# Altium schematic sheet USB_OTG .SchDoc: USB OTG HS
size A4; Project: STM32H7-DK; Date: Not used; ApprovedBy: Not used; CheckedBy: Not used; Author: Not used; CompanyName: STMicroelectronics; DrawnBy: Not used; Engineer: Not used; Organization: Not used; Address1: Not used; Address2: Not used; Address3: Not used; Address4: Not used; DocumentNumber: Not used; Revision: Not used; SheetNumber: 15; SheetTotal: 16; CurrentTime: Not used; CurrentDate: Not used; Time: Not used; DocumentFullPathAndName: Not used; DocumentName: Not used; ModifiedDate: Not used; ImagePath: Not used; ProjectName: Not used; Application_BuildNumber: Not used
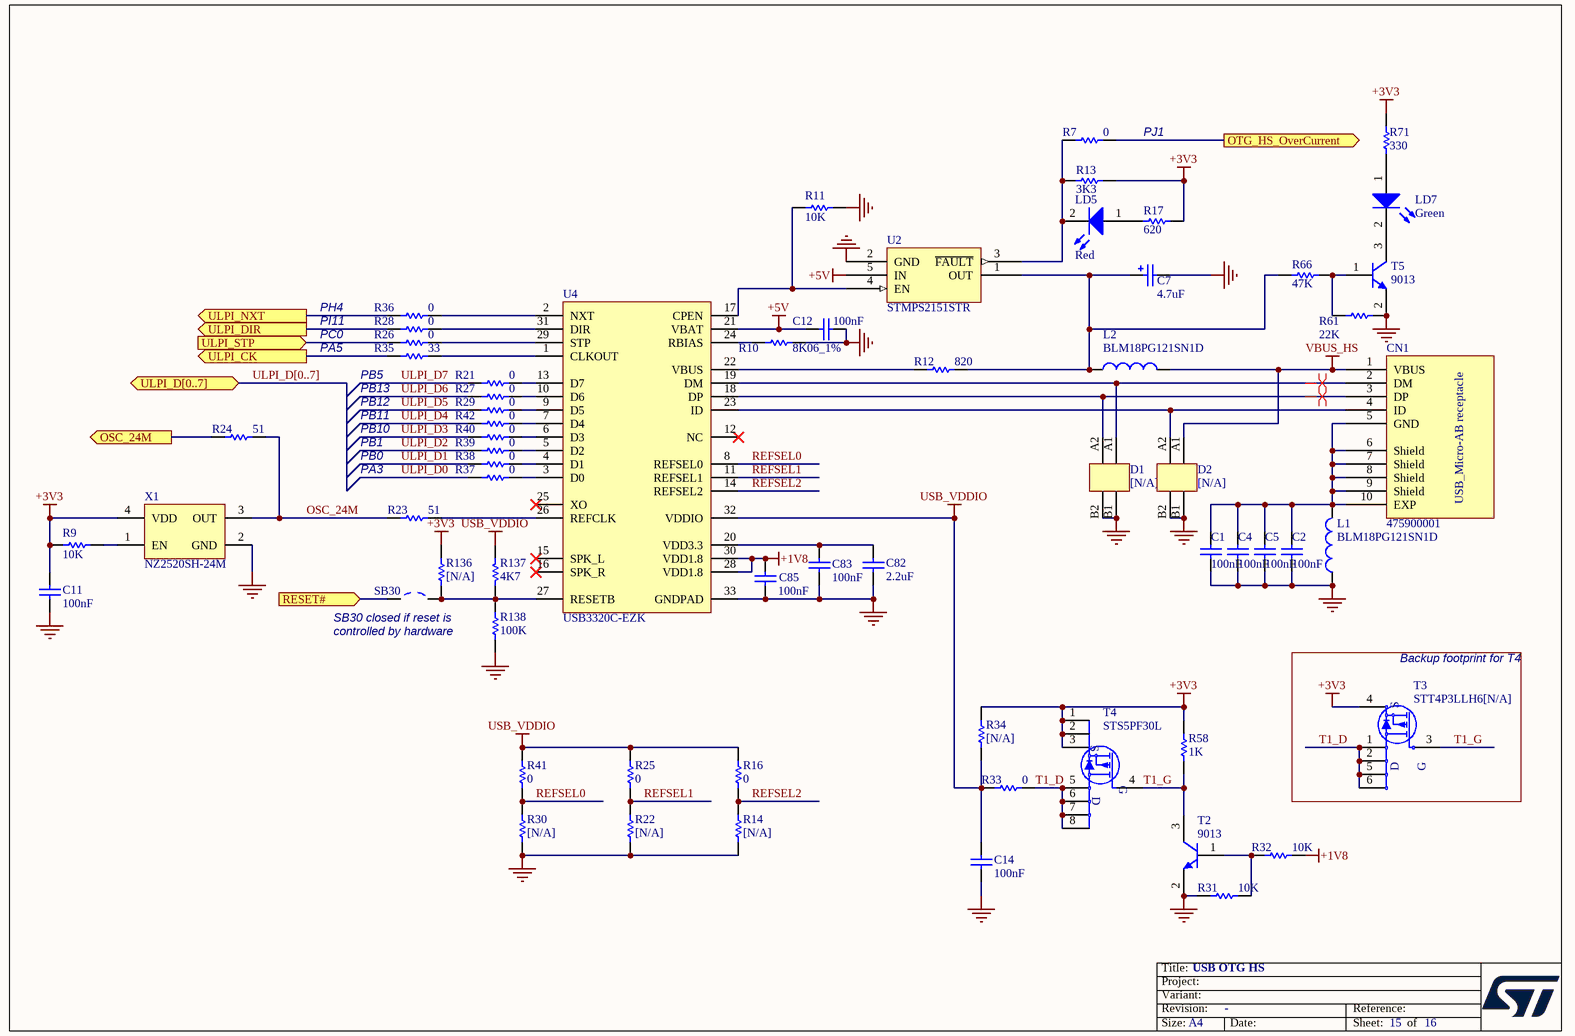
[diagram p0: USB_OTG .SchDoc]

## Parts
C1  100nF  [0603C]
C2  100nF  [0603C]
C4  100nF  [0603C]
C5  100nF  [0603C]
C7  4.7uF  [TAN-A]
C11  100nF  [0603C]
C12  100nF  [0603C]
C14  100nF  [0603C]
C82  2.2uF  [1206C]
C83  100nF  [0603C]
C85  100nF  [0603C]
CN1  475900001  [MOLEX_47590001]
D1  [N/A]  [BGA4_0R4_1X1]
D2  [N/A]  [BGA4_0R4_0R8X0R8]
L1  BLM18PG121SN1D  [0603L]
L2  BLM18PG121SN1D  [0603L]
LD5  Red  [0603D]
LD7  Green  [0603D]
R7  0  [0603R]
R9  10K  [0603R]
R10  8K06_1%  [0603R]
R11  10K  [0603R]
R12  820  [0603R]
R13  3K3  [0603R]
R14  [N/A]  [0603R]
R16  0  [0603R]
R17  620  [0603R]
R21  0  [0603R]
R22  [N/A]  [0603R]
R23  51  [0603R]
R24  51  [0603R]
R25  0  [0603R]
R26  0  [0603R]
R27  0  [0603R]
R28  0  [0603R]
R29  0  [0603R]
R30  [N/A]  [0603R]
R31  10K  [0603R]
R32  10K  [0603R]
R33  0  [0603R]
R34  [N/A]  [0603R]
R35  33  [0603R]
R36  0  [0603R]
R37  0  [0603R]
R38  0  [0603R]
R39  0  [0603R]
R40  0  [0603R]
R41  0  [0603R]
R42  0  [0603R]
R58  1K  [0603R]
R61  22K  [0603R]
R66  47K  [0603R]
R71  330  [0603R]
R136  [N/A]  [0603R]
R137  4K7  [0603R]
R138  100K  [0603R]
SB30  Solder Bridge OFF  [SB_0603]  (value not drawn)
T2  9013  [SOT-23]
T3  STT4P3LLH6[N/A]  [SOT23-6L]
T4  STS5PF30L  [SOIC8_1R27_4R9X6]
T5  9013  [SOT-23]
U2  STMPS2151STR  [SOT23-5]
U4  USB3320C-EZK  [QFN32_0R5_5X5]
X1  NZ2520SH-24M  [OSC_4SM_2R5X2]

## Blocks framed on the sheet
Backup footprint for T4: T3

## Ports
OSC_24M (out), OTG_HS_OverCurrent (out), RESET# (in), ULPI_CK (out), ULPI_D[0..7] (bidir), ULPI_DIR (out), ULPI_NXT (out), ULPI_STP (in)

## Nets
+1V8: C85.1 R32.1 U4.28(VDD1.8) U4.30(VDD1.8)
+3V3: C11.2 R9.1 R13.1 R17.2 R34.1 R58.2 R71.2 R136.2 T3.4(S) T4.1(S) T4.2(S) T4.3(S) X1.4(VDD)
+5V: C12.1 U2.5(IN) U4.21(VBAT)
GND: C1.2 C2.2 C4.2 C5.2 C7.2 C11.1 C12.2 C14.2 C82.1 C83.2 C85.2 D1.B1 D1.B2 D2.B1 D2.B2 L1.1 R10.2 R11.1 R14.2 R22.2 R30.2 R31.2 R61.1 R138.1 T2.2(E) T5.2(E) U2.2(GND) U4.33(GNDPAD) X1.2(GND)
USB_VDDIO: C14.1 R16.2 R25.2 R33.2 R34.2 R41.2 R137.2 U4.32(VDDIO)
VBUS_HS: CN1.1(VBUS) D2.A1 L2.2
OSC_24M: R23.2 R24.1 X1.3(OUT)
OSC_24M: R24.2 ; port OSC_24M  [a separate net that carries the same name]
OTG_HS_OverCurrent: R7.1 ; port OTG_HS_OverCurrent
REFSEL0: R30.1 R41.1 U4.8(REFSEL0)
REFSEL1: R22.1 R25.1 U4.11(REFSEL1)
REFSEL2: R14.1 R16.1 U4.14(REFSEL2)
RESET#: SB30.1 ; port RESET#
T1_D: R33.1 T3.1(S) T3.2(S) T3.5(D) T3.6(D) T4.5(D) T4.6(D) T4.7(D) T4.8(D)
T1_G: R58.1 T2.3(C) T3.3(G) T4.4(G)
ULPI_CK: R35.2 ; port ULPI_CK
ULPI_D0: R37.2
ULPI_D1: R38.2
ULPI_D2: R39.2
ULPI_D3: R40.2
ULPI_D4: R42.2
ULPI_D5: R29.2
ULPI_D6: R27.2
ULPI_D7: R21.2
ULPI_DIR: R28.2 ; port ULPI_DIR
ULPI_NXT: R36.2 ; port ULPI_NXT
ULPI_STP: R26.2 ; port ULPI_STP
NetC1_1: C1.1 C2.1 C4.1 C5.1 CN1.5(GND) CN1.6(Shield) CN1.7(Shield) CN1.8(Shield) CN1.9(Shield) CN1.10(EXP) L1.2
NetC7_1: C7.1 L2.1 R12.2 R66.2 U2.1(OUT)
NetC82_2: C82.2 C83.1 U4.20(VDD3.3)
NetCN1_2: CN1.2(DM) D1.A1 U4.19(DM)
NetCN1_3: CN1.3(DP) D1.A2 U4.18(DP)
NetCN1_4: CN1.4(ID) D2.A2 U4.23(ID)
NetLD5_1: LD5.1(A) R17.1
NetLD5_2: LD5.2(K) R7.2 R13.2 U2.3(~{FAULT})
NetLD7_1: LD7.1(A) R71.1
NetLD7_2: LD7.2(K) T5.3(C)
NetR9_2: R9.2 X1.1(EN)
NetR10_1: R10.1 U4.24(RBIAS)
NetR11_2: R11.2 U2.4(EN) U4.17(CPEN)
NetR12_1: R12.1 U4.22(VBUS)
NetR21_1: R21.1 U4.13(D7)
NetR23_1: R23.1 U4.26(REFCLK)
NetR26_1: R26.1 U4.29(STP)
NetR27_1: R27.1 U4.10(D6)
NetR28_1: R28.1 U4.31(DIR)
NetR29_1: R29.1 U4.9(D5)
NetR31_1: R31.1 R32.2 T2.1(B)
NetR35_1: R35.1 U4.1(CLKOUT)
NetR36_1: R36.1 U4.2(NXT)
NetR37_1: R37.1 U4.3(D0)
NetR38_1: R38.1 U4.4(D1)
NetR39_1: R39.1 U4.5(D2)
NetR40_1: R40.1 U4.6(D3)
NetR42_1: R42.1 U4.7(D4)
NetR61_2: R61.2 R66.1 T5.1(B)
NetR136_1: R136.1 R137.1 R138.2 SB30.2 U4.27(RESETB)

Not connected (* = marked no-connect by the designer): U4 12(NC)* 15(SPK_L)* 16(SPK_R)* 25(XO)*

## Buses and harness runs
bus ULPI_D[0..7] = port ULPI_D[0..7]

## Layout directives
differential pair: NetCN1_2, NetCN1_3

## Notes on the sheet
- PJ1
- PH4
- PI11
- PC0
- PA5
- PB5
- PB1
- PB10
- PB11
- PB12
- PB13
- (near R23) PA3
- PB0
- SB30 closed if reset is
- controlled by hardware
- Title:
- Project:
- Size:
- Revision:
- Variant:
- A4
- -
- Date:
- Reference:
- Sheet:
- of
- (in symbol 475900001) USB_Micro-AB receptacle

## Library data of the parts
C1 C2 C4 C5 C12 C14 C83 C85 = Cap: Capacitor; Value: 10nF; Published: 8-Jun-2000; Revision: July-2002: Re-released for DXP Platform.; Publisher: Altium Limited
C7 = Cap Pol1: Polarized Capacitor (Radial); Value: 47uF; Published: 8-Jun-2000; Revision: July-2002: Re-released for DXP Platform.; Publisher: Altium Limited
C11 = CAP: Capacitor; Published: 8-Jun-2000; Revision: July-2002: Re-released for DXP Platform.; Publisher: Altium Limited; Value: 100nF
C82 = MCD-00008: Capacitor,2.2uF,16V, X7R,10%,1206; Manufacturer_Part_Number: CC1206KKX7R7BB225; Manufacturer: YAGEO; Alternate_Manufacturer_Part_Number: C1206C225K4RAC; Alternate_Manufacturer: KEMET; Provided_By: Subcon; Initial_Board_Reference: mb1274; Internal_Part_Number: MCD-00008; Value: 2.2uF; Status: Released; Package: 1206; ComponentLink1Description: Yageo_Capacitor_X7R-series.pdf; ECCN_US: n/a; ECCN_EU: n/a; Part_Type: Capacitor
CN1 = 475900001: Manuf_1: MOLEX; Fitted: YES; Ordered by: Subcon; ECCN_US/EU: EAR99/NEC; Manuf_Part_1: 475900001
D1 = USBULC6-2F3: Fitted: NO; Ordered by: STM; ECCN_US/EU: EAR99/NEC; Manuf_1: STM; Manuf_Part_1: USBULC6-2F3
D2 = ESDA14V2-2BF3: Fitted: NO; Ordered by: STM; ECCN_US/EU: EAR99/NEC; Manuf_1: STM; Manuf_Part_1: ESDA14V2-2BF3
L1 L2 = BEAD_120R_2A_0603: Bead,120R,2A,0603,BLM18PG121SN1D,MURATA; Manuf_Part_3: FCM1608KF-601T03; Manuf_2: TDK; Manuf_Part_2: MPZ1608S300A; Manuf_3: Tai-tech; Value: 100uH; Description_3: Bead,600R,350mA,0603,FCM1608KF-601T03,Tai-tech; Description_2: Bead,30R,5A,0603,MPZ1608S300A,TDK; Revision: July-2002: Re-released for DXP Platform.; ECCN_US/EU: n/a; Manuf_Part_1: BLM18PG121SN1D; Manuf_1: MURATA
LD5 LD7 = LED2: Typical RED, GREEN, YELLOW, AMBER GaAs LED; Published: 8-Jun-2000; Revision: July-2002: Re-released for DXP Platform.; Publisher: Altium Limited
R7 R16 R17 R21 R23-R29 R33 R35-R42 R137 = Res1: Resistor; Value: 1K; Published: 8-Jun-2000; Revision: July-2002: Re-released for DXP Platform.; Publisher: Altium Limited
R9 = Res_10K_1%_0402: Resistor,10K,0402,1%,YAGEO; Value: 10K; Manuf_1: YAGEO; ECCN_US/EU: n/a
R10 = Res_8K06_1%_0402: Resistor,8K06,0402,1%,YAGEO; Value: 8K06; Manuf_1: YAGEO; ECCN_US/EU: n/a; Distrib: DIGIKEY
R11-R13 R31 R32 R61 R66 R71 = res1: Resistor; Value: 1K; Published: 8-Jun-2000; Revision: July-2002: Re-released for DXP Platform.; Publisher: Altium Limited
R14 R22 R30 R34 R136 = res1: Resistor; Value: 1K; Ordered by: Subcon; ECCN_US/EU: NA; Fitted: NO; Published: 8-Jun-2000; Revision: July-2002: Re-released for DXP Platform.; Publisher: Altium Limited
R58 = res1: Resistor; Published: 8-Jun-2000; Revision: July-2002: Re-released for DXP Platform.; Publisher: Altium Limited; Value: 1K
R138 = Resistor_ST: Resistor 0402 / 0603 / 0805; Value: 10K
SB30 = SB_OFF: Fitted: NO; Ordered by: Subcon; Revision: July-2002: Re-released for DXP Platform.; ECCN_US/EU: n/a
T2 T5 = NPN: NPN Bipolar Transistor; Code - JEDEC: TO-226-AA; Published: 8-Jun-2000; Revision: July-2002: Re-released for DXP Platform.; Publisher: Altium Limited
T3 = STT7P2UH7: STripFET VII DeepGATE Power MOSFET, P-CHANNEL 20 V, 0.0146, 7 A - SOT23-6L; Manuf_1: STM; Fitted: NO; Ref St: xxxxxxxx; ECCN_US/EU: EAR99/NEC; Comments: exclusive with T4; Manuf_Part_1: STT4P3LLH6; Order: STT4P3LLH6; Distrib: ST; Ordered by: STM
T4 = STS7PF30L
U2 = STMPS2141STR: Fitted: YES; Ordered by: STM; ECCN_US/EU: EAR99/NEC; Manuf_1: STM; Manuf_Part_1: STMPS2151STR
U4 = USB3320C-EZK: USB3320C,  Hi-Speed USB Host, Device or OTG PHY with ULPI Low Pin Interface; Manuf_1: MICROCHIP; Manuf_Part_1: USB3320C-EZK-TR; Fitted: YES; Ordered by: Subcon; ECCN_US/EU: EAR99/NEC
X1 = OSC_24M_NZ2520SB: Oscillator 24.00Mhz, -+50PPM, 3.3V, Temp -55 to +125癈; Manuf_Part_1: NZ2520SB 24MHz END4869A; Manuf_1: NDK; Manuf_Part_2: KC2520B24.0000C10E00; Manuf_2: AVX Corp/Kyocera Corp; Ordered by: STM; ECCN_US/EU: EAR99/NEC; Ref St: 9157032; Fitted: YES